# Altium project Stream_Deck.PrjPcb
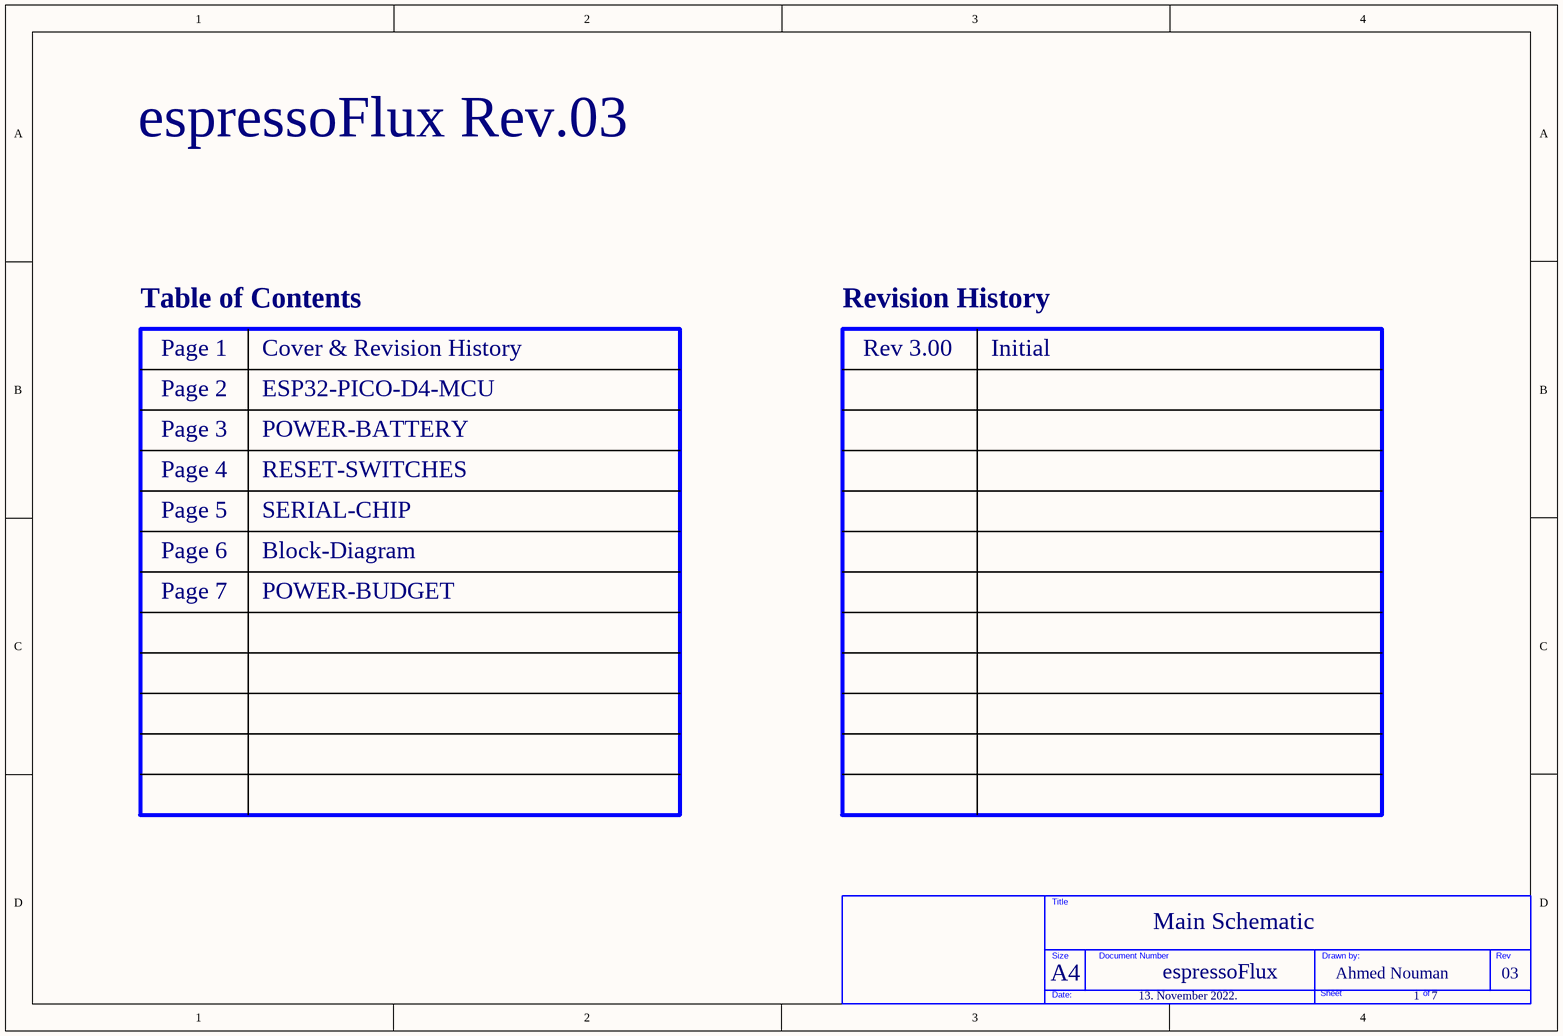
[diagram p0: Main Schematic.SchDoc]
7 sheets, 121 parts. Net scope: flat (ports and power ports of the same name join across sheets).
Board file: main.PcbDoc
Sheets:
  Main Schematic.SchDoc
  ESP32-PICO-D4-MCU.SchDoc
  POWER-BATTERY.SchDoc
  RESET-SWITCHES.SchDoc
  SERIAL-CHIP.SchDoc
  BLOCK-DIAGRAM.SchDoc
  POWER-BUDGET.SchDoc

## Sheet Main Schematic.SchDoc
size A4; PageSetup: Record=PageOptions|CenterHorizontal=True|CenterVertical=True|PrintScale=0.49|XCorrection=1.00|YCorrection=1.00|PrintKind=1|BorderSize=5000000|LeftOffset=0|BottomOffset=0|Orientation=2|PaperLength=1000|PaperWidth=1000|Scale=100|PaperSource=15|PrintQuality=1200|MediaType=1|DitherType=10|PrintScaleMode=1|PaperKind=Letter|PaperIndex=1; SheetNumber: 1; SheetTotal: 7

### Parts
(Parts that share a designator on the sheet are numbered #1, #2 ... from top to bottom, then left to right.)
?#1  (no value)  (graphical)

### Notes on the sheet
- espressoFlux Rev.03
- Table of Contents
- Revision History
- Page 1
- Cover & Revision History
- Rev 3.00
- Initial
- Page 2
- Page 3
- ESP32-PICO-D4-MCU
- POWER-BATTERY
- Page 4
- Page 5
- RESET-SWITCHES
- SERIAL-CHIP
- Page 6
- Block-Diagram
- Page 7
- POWER-BUDGET
- A4
- Main Schematic
- espressoFlux
- Ahmed Nouman
- 03
- 13. November 2022.
- 1    7
- Title
- Size
- Document Number
- Drawn by:
- Rev
- Date:
- Sheet
- of

### Library data of the parts
?#1 = TITLE BLOCK_BLANK

## Sheet ESP32-PICO-D4-MCU.SchDoc
size A4; SheetNumber: 2; SheetTotal: 7
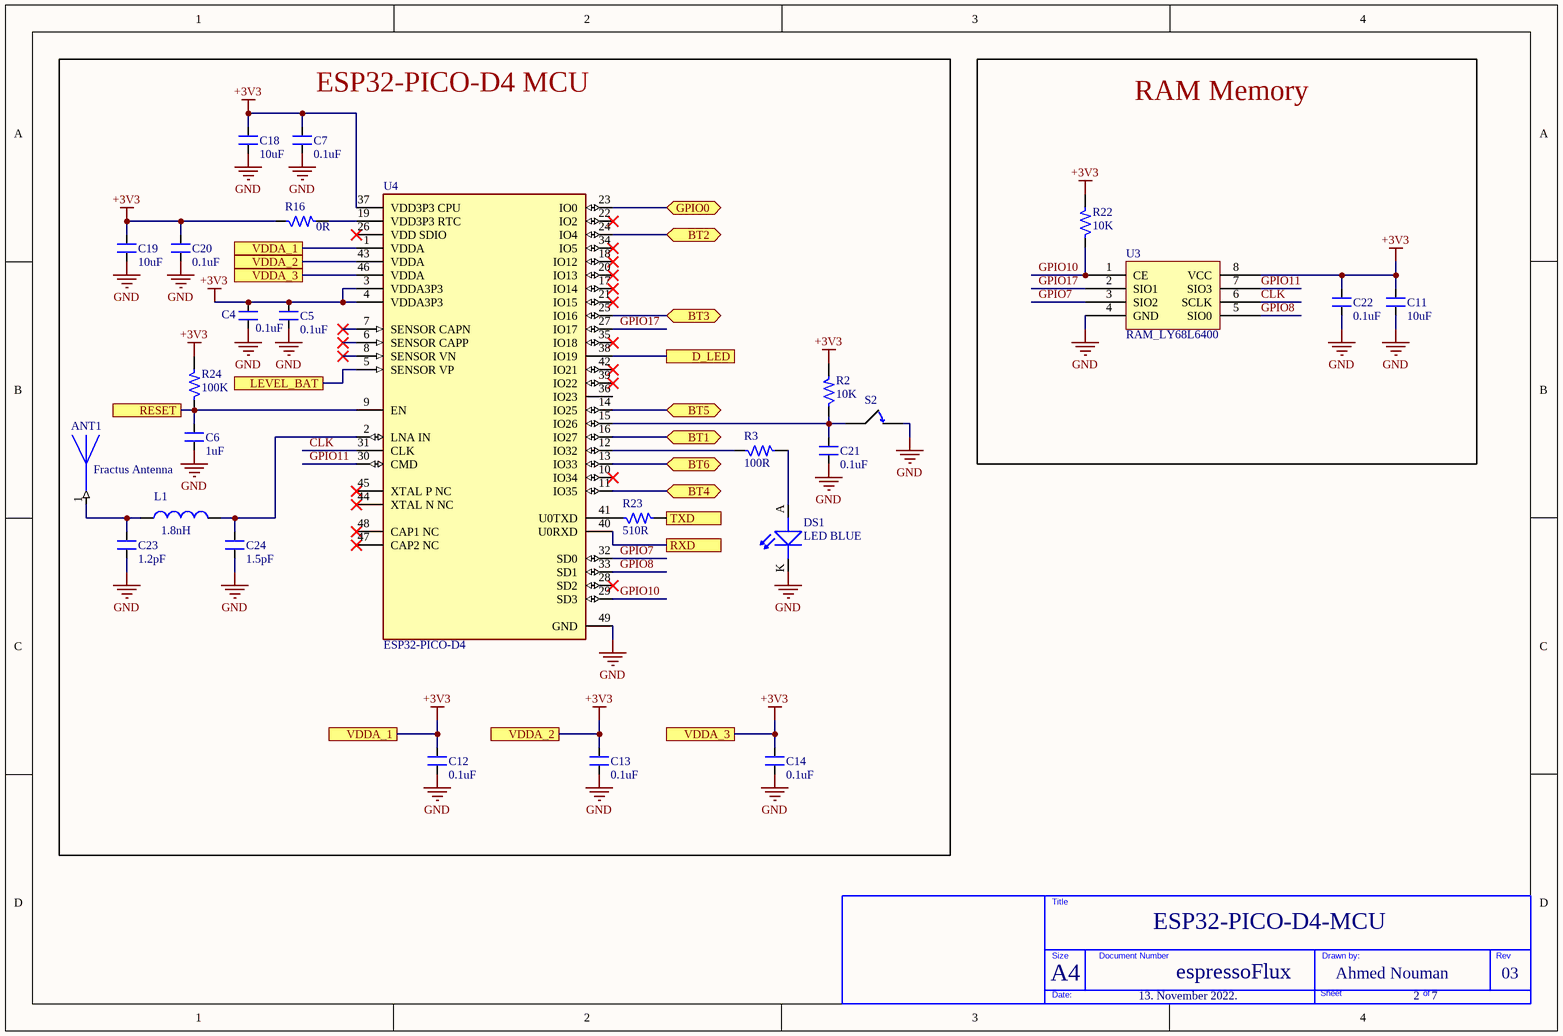
[diagram p1: ESP32-PICO-D4-MCU.SchDoc]

### Parts
(Parts that share a designator on the sheet are numbered #1, #2 ... from top to bottom, then left to right.)
?#2  (no value)  (graphical)
ANT1  Fractus Antenna  [Fractus_Antenna_NN01-102]
C4  0.1uF  [CAP_0805]
C5  0.1uF  [CAP_0805]
C6  1uF  [CAP_0805]
C7  0.1uF  [CAP_0805]
C11  10uF  [CAP_0805]
C12  0.1uF  [CAP_0805]
C13  0.1uF  [CAP_0805]
C14  0.1uF  [CAP_0805]
C18  10uF  [CAP_0805]
C19  10uF  [CAP_0805]
C20  0.1uF  [CAP_0805]
C21  0.1uF  [CAP_0805]
C22  0.1uF  [CAP_0805]
C23  1.2pF  [CAPC1608N]
C24  1.5pF  [CAPC1608N]
DS1  LED BLUE  [LED_0805]
L1  1.8nH  [RESC1608N]
R2  10K  [RES_0805]
R3  100R  [RES_0805]
R16  0R  [RES_0805]
R22  10K  [RES_0805]
R23  510R  [RES_0805]
R24  100K  [RES_0805]
S2  Button Tactile Switch, NO 0.05 A 0.8mm  [Button8014X17N]  (value not drawn)
U3  RAM_LY68L6400  [SOP-8]
U4  ESP32-PICO-D4  [Espressif_Systems_0_IPC_A]

### Blocks framed on the sheet
ESP32-PICO-D4 MCU: ANT1 C4-C7 C12-C14 C18-C21 C23 C24 DS1 L1 R2 R3 R16 R23 R24 S2 U4
RAM Memory: C11 C22 R22 U3

### Ports
BT1 (bidir), BT2 (bidir), BT3 (bidir), BT4 (bidir), BT5 (bidir), BT6 (bidir), D_LED, GPIO0 (bidir), LEVEL_BAT, RESET, RXD, TXD, VDDA_1, VDDA_2, VDDA_3

### Nets
+3V3: C4.2 C5.2 C7.2 C11.2 C12.2 C13.2 C14.2 C18.2 C19.2 C20.2 C22.2 R2.2 R16.1 R22.2 R24.2 U3.8(VCC) U4.1(VDDA) U4.3(VDDA3P3) U4.4(VDDA3P3) U4.37(VDD3P3_CPU) U4.43(VDDA) U4.46(VDDA) ; port VDDA_1, port VDDA_2, port VDDA_3
GND: C4.1 C5.1 C6.1 C7.1 C11.1 C12.1 C13.1 C14.1 C18.1 C19.1 C20.1 C21.1 C22.1 C23.1 C24.1 DS1.K(CATHODE) S2.2 U3.4(GND) U4.49(GND)
BT1: U4.16(IO27) ; port BT1
BT2: U4.24(IO4) ; port BT2
BT3: U4.25(IO16) ; port BT3
BT4: U4.11(IO35) ; port BT4
BT5: U4.14(IO25) ; port BT5
BT6: U4.13(IO33) ; port BT6
CLK: U3.6(SCLK) U4.31(CLK)
D_LED: U4.38(IO19) ; port D_LED
GPIO0: U4.23(IO0) ; port GPIO0
GPIO7: U3.3(SIO2) U4.32(SD0)
GPIO8: U3.5(SIO0) U4.33(SD1)
GPIO10: R22.1 U3.1(CE) U4.29(SD3)
GPIO11: U3.7(SIO3) U4.30(CMD)
GPIO17: U3.2(SIO1) U4.27(IO17)
LEVEL_BAT: U4.5(SENSOR_VP) ; port LEVEL_BAT
RESET: C6.2 R24.1 U4.9(EN) ; port RESET
RXD: U4.40(U0RXD) ; port RXD
TXD: R23.2 ; port TXD
NetANT1_1: ANT1.1 C23.2 L1.1
NetC21_2: C21.2 R2.1 S2.1 U4.15(IO26)
NetC24_2: C24.2 L1.2 U4.2(LNA_IN)
NetDS1_A: DS1.A(ANODE) R3.2
NetR3_1: R3.1 U4.12(IO32)
NetR16_2: R16.2 U4.19(VDD3P3_RTC)
NetR23_1: R23.1 U4.41(U0TXD)

Not connected (* = marked no-connect by the designer): U4 6(SENSOR_CAPP)* 7(SENSOR_CAPN)* 8(SENSOR_VN)* 10(IO34)* 17(IO14)* 18(IO12)* 20(IO13)* 21(IO15)* 22(IO2)* 26(VDD_SDIO)* 28(SD2)* 34(IO5)* 35(IO18)* 36(IO23) 39(IO22)* 42(IO21)* 44(XTAL_N_NC)* 45(XTAL_P_NC)* 47(CAP2_NC)* 48(CAP1_NC)*

### Notes on the sheet
- A4
- ESP32-PICO-D4-MCU
- espressoFlux
- Ahmed Nouman
- 03
- 13. November 2022.
- 2    7
- Title
- Size
- Document Number
- Drawn by:
- Rev
- Date:
- Sheet
- of

### Library data of the parts
?#2 = TITLE BLOCK_BLANK
ANT1 = ANT_2.45GHz_Bluetooth_WLAN_Zigbee_1.7dBi_NN01-102: 2.45GHz Bluetooth, WLAN, Zigbe Chip RF Antenna 2.4GHz ~ 2.5GHz 1.7dBi Solder Surface Mount
C4 C5 C7 C12-C14 C20-C22 = CAP_0.1uF-50V-10%-0805: 0.1µF ±10% 50V Ceramic Capacitor X7R 0805 (2012 Metric); Manufacturer: Samsung; Manufacturer Part Number: CL21B104KBCNNNC; Alternate Part Number-1: NA; Case/Package: 0805; Supplier-1: SIRICOM; Supplier Part Number-1: 0805B104K500CT
C6 C23 C24 = CAP_1uF-50V-10%-0805_1: 1µF ±10% 50V Ceramic Capacitor X7R 0805 (2012 Metric); Manufacturer: Samsung; Manufacturer Part Number: CL21B104KBCNNNC; Alternate Part Number-1: NA; Case/Package: 0805; Supplier-1: SIRICOM; Supplier Part Number-1: 0805B104K500CT
C11 C18 C19 = CAP_10uF-50V-10%-0805_1: 10µF ±10% 50V Ceramic Capacitor X7R 0805 (2012 Metric); Manufacturer: Samsung; Manufacturer Part Number: CL21B104KBCNNNC; Alternate Part Number-1: NA; Case/Package: 0805; Supplier-1: SIRICOM; Supplier Part Number-1: 0805B104K500CT
DS1 = LED_BLUE-3V3-20mA-0805: Blue 470nm LED Indication - Discrete 3.3V 0805 (2012 Metric); Manufacturer: Vishay Lite-On; Manufacturer Part Number: LTST-C171TBKT; Alternate Part Number-1: NA; Case/Package: 0805; Supplier-1: SP ROAD; Supplier Part Number-1: LTST-C171TBKT
L1 = Inductor: Code_IEC: 1005; Value: MPZ1608S601A; Published: 8-Jun-2000; LatestRevisionDate: 17-Jul-2002; LatestRevisionNote: Re-released for DXP Platform.; PackageReference: 0402-A; Publisher: Altium Limited; Code_JEITA: 0402
R2 R22 = RES_10K-0.125W-1%-0805: 10 kOhms ±1% 0.125W, 1/8W Chip Resistor 0805 (2012 Metric) Automotive AEC-Q200 Thick Film; Manufacturer: CTS; Manufacturer Part Number: WR08X1002FTL; Case/Package: 0805; Supplier-1: SIRICOM; Supplier Part Number-1: WR08X1002FTL; Alternate Part Number-1: WR08X1002FTL
R3 = RES_100R-0.125W-1%-0805: 100 Ohms ±1% 0.125W, 1/8W Chip Resistor 0805 (2012 Metric) Automotive AEC-Q200, Pulse Withstanding Thick Film; Manufacturer: Walsin; Manufacturer Part Number: WR08X1000FTL; Case/Package: 0805; Supplier-1: SIRICOM; Supplier Part Number-1: WR08X1000FTL; Alternate Part Number-1: WR08X1000FTL
R16 = RES_0R-0.125W-1%-0805: 0 Ohms Jumper 0.125W, 1/8W Chip Resistor 0805 (2012 Metric) Automotive AEC-Q200 Thick Film; Manufacturer: Walsin; Manufacturer Part Number: WR08X000PTL; Case/Package: 0805; Supplier-1: SIRICOM; Supplier Part Number-1: WR08X000PTL; Alternate Part Number-1: WR08X000PTL
R23 = RES_510R-0.125W-1%-0805: 510 Ohms ±1% 0.125W, 1/8W Chip Resistor 0805 (2012 Metric) Thin Film; Manufacturer: Yageo; Manufacturer Part Number: RT0805FRE07510RL; Alternate Part Number-1: NA; Case/Package: 0805; Supplier-1: SIRICOM; Supplier Part Number-1: WR08X5100FTL
R24 = RES_10K-0.125W-1%-0805: 100 kOhms ±1% 0.125W, 1/8W Chip Resistor 0805 (2012 Metric) Automotive AEC-Q200 Thick Film; Manufacturer: CTS; Manufacturer Part Number: WR08X1002FTL; Case/Package: 0805; Supplier-1: SIRICOM; Supplier Part Number-1: WR08X1002FTL; Alternate Part Number-1: WR08X1002FTL
S2 = Button Tactile Switch, NO 0.05 A 0.8mm: Manufacturer: C & K; Manufacturer Part No.: B3F1000; State: Normaly Open; Date Created: 25 February 2015; Creator: R Kanjee; RS Stock No.: 516-255

## Sheet POWER-BATTERY.SchDoc
size A4; SPICEModelCacheDLZXOQBQ: <root> / <DocumentId>DLZXOQBQ</DocumentId> / <CacheFrame Number="0"> / <Model Name="skydiode" Kind="MDL"> / <Text>*Default Schottky Diode / *Schottky Diode Pinout: A,K / .MODEL SKYDIODE D(EG=0.69 XTI=2)</Text> / </Model> / </CacheFrame> / </root>; SheetNumber: 3; SheetTotal: 7
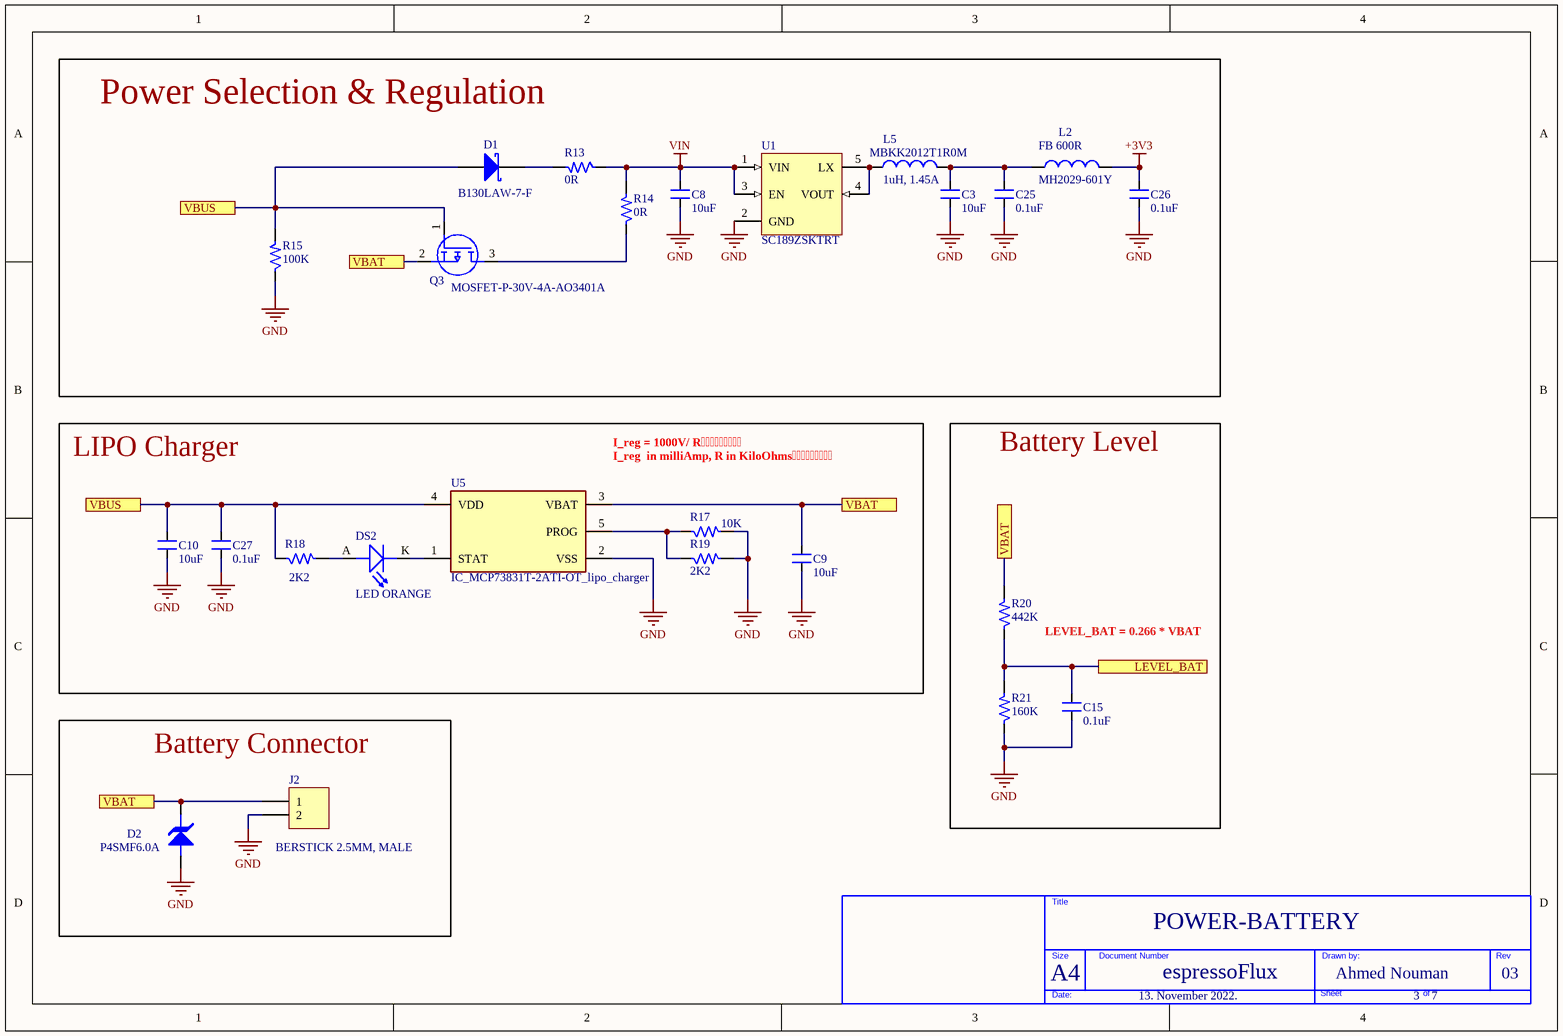
[diagram p2: POWER-BATTERY.SchDoc]

### Parts
(Parts that share a designator on the sheet are numbered #1, #2 ... from top to bottom, then left to right.)
?#3  (no value)  (graphical)
C3  10uF  [CAP_0805]
C8  10uF  [CAP_0805]
C9  10uF  [CAP_0805]
C10  10uF  [CAP_0805]
C15  0.1uF  [CAP_0805]
C25  0.1uF  [CAP_0805]
C26  0.1uF  [CAP_0805]
C27  0.1uF  [CAP_0805]
D1  B130LAW-7-F  [SOD123 - DOT]
D2  P4SMF6.0A  [SOD123FL]
DS2  LED ORANGE  [LED_0805]
J2  BERSTICK 2.5MM, MALE  [CON2_100_43D62_TH_ST]
L2  MH2029-601Y  [INDC2012N]
L5  MBKK2012T1R0M  [INDC2012N]
Q3  MOSFET-P-30V-4A-AO3401A  [P_channelMos_AO3401A]
R13  0R  [RES_0805]
R14  0R  [RES_0805]
R15  100K  [RES_0805]
R17  10K  [RES_0805]
R18  2K2  [RES_0805]
R19  2K2  [RES_0805]
R20  442K  [RES_0805]
R21  160K  [RES_0805]
U1  SC189ZSKTRT  [SOT23-5]
U5  IC_MCP73831T-2ATI-OT_lipo_charger  [SOT23-5]

### Blocks framed on the sheet
Power Selection & Regulation: C3 C8 C25 C26 D1 L2 L5 Q3 R13-R15 U1
LIPO Charger: C9 C10 C27 DS2 R17-R19 U5
Battery Level: C15 R20 R21
Battery Connector: D2 J2

### Ports
LEVEL_BAT, VBAT, VBUS

### Nets
+3V3: C26.2 L2.2
GND: C3.1 C8.1 C9.1 C10.1 C15.1 C25.1 C26.1 C27.1 D2.1 J2.2 R15.1 R17.2 R19.2 R21.1 U1.2(GND) U5.2(VSS)
VIN: C8.2 R13.1 R14.2 U1.1(VIN) U1.3(EN)
LEVEL_BAT: C15.2 R20.1 R21.2 ; port LEVEL_BAT
VBAT: C9.2 D2.2 J2.1 Q3.2(S) R20.2 U5.3(VBAT) ; port VBAT
VBUS: C10.2 C27.2 D1.1(A) Q3.1(G) R15.2 R18.1 U5.4(VDD) ; port VBUS
NetC3_2: C3.2 C25.2 L2.1 L5.2
NetD1_2: D1.2(K) R13.2
NetDS2_A: DS2.A(ANODE) R18.2
NetDS2_K: DS2.K(CATHODE) U5.1(STAT)
NetL5_1: L5.1 U1.4(VOUT) U1.5(LX)
NetQ3_3: Q3.3(D) R14.1
NetR17_1: R17.1 R19.1 U5.5(PROG)

### Notes on the sheet
- (near L2) FB 600R
- 1uH, 1.45A
- I_reg = 1000V/ R
- I_reg  in milliAmp, R in KiloOhms
- LEVEL_BAT = 0.266 * VBAT
- A4
- POWER-BATTERY
- espressoFlux
- Ahmed Nouman
- 03
- 13. November 2022.
- 3    7
- Title
- Size
- Document Number
- Drawn by:
- Rev
- Date:
- Sheet
- of

### Library data of the parts
?#3 = TITLE BLOCK_BLANK
C3 C8 = CAP_1uF-50V-10%-0805_1: as C6 on sheet ESP32-PICO-D4-MCU; Case/Package: 0805; Supplier-1: SIRICOM; Supplier Part Number-1: 0805B104K500CT
C9 C10 = CAP_10uF-50V-10%-0805_1: as C11 on sheet ESP32-PICO-D4-MCU; Case/Package: 0805; Supplier-1: SIRICOM; Supplier Part Number-1: 0805B104K500CT
C15 C25-C27 = CAP_0.1uF-50V-20%-0805: 0.1µF ±20% 50V Ceramic Capacitor X7R 0805 (2012 Metric); Manufacturer: Samsung Electro-Mechanics; Manufacturer Part Number: CL21B104MBCNNNC; Alternate Part Number-1: NA; Case/Package: 0805; Supplier-1: SIRICOM; Supplier Part Number-1: 0805B104K500CT
D1 = D Schottky: Schottky Diode; Published: 8-Jun-2000; LatestRevisionDate: 17-Jul-2002; LatestRevisionNote: Re-released for DXP Platform.; PackageReference: SMB; Publisher: Altium Limited; PackageDescription: DO-214-AA/SMB; 2 C-Bend Leads; Body 5.3 x 3.6 mm, inc. leads (LxW); Code_JEDEC: DO-214-AA
D2 = TVS-UNIDIRECTIONAL: Value: *
DS2 = LED_ORANGE-2V-20mA-0805: Orange 605nm LED Indication - Discrete 2V 0805 (2012 Metric); Manufacturer: Vishay Lite-On; Manufacturer Part Number: LTST-C170KFKT; Alternate Part Number-1: NA; Case/Package: 0805; Supplier-1: SP ROAD; Supplier Part Number-1: LTST-C170KFKT
J2 = CON-BS-PLG_2X1-100-ST-TH: 2 Pins, 1 Row 2.54mm Pitch, Straight bergstrip, Male; Manufacturer Part Number: NA; Manufacturer: Samtec; Case/Package: TH-CON; Supplier-1: SP ROAD; Supplier Part Number-1: NA; Alternate Part Number-1: NA
L2 = Inductor: Code_IEC: 1005; Value: MPZ1608S601A; Published: 8-Jun-2000; LatestRevisionDate: 17-Jul-2002; LatestRevisionNote: Re-released for DXP Platform.; PackageReference: 0402-A; Publisher: Altium Limited; Code_JEITA: 0402
L5 = Inductor: 1 µH Shielded Drum Core, Wirewound Inductor 1.45 A 106mOhm Max 0805 (2012 Metric); Code_IEC: 1005; Value: MPZ1608S601A; Published: 8-Jun-2000; LatestRevisionDate: 17-Jul-2002; LatestRevisionNote: Re-released for DXP Platform.; PackageReference: 0402-A; Publisher: Altium Limited; Code_JEITA: 0402
Q3 = MOSFET-P-30V-4A-AO3401A: 30V P-Channel MOSFET 4A Rdson = 85 mOhms
R13 R14 = RES_0R-0.125W-1%-0805: as R16 on sheet ESP32-PICO-D4-MCU; Case/Package: 0805; Supplier-1: SIRICOM; Supplier Part Number-1: WR08X000PTL; Alternate Part Number-1: WR08X000PTL
R15 = RES_100K-0.125W-1%-0805: 100 kOhms ±1% 0.125W, 1/8W Chip Resistor 0805 (2012 Metric) Automotive AEC-Q200 Thick Film; Manufacturer: Walsin; Manufacturer Part Number: WR08X1003FTL; Alternate Part Number-1: NA; Case/Package: 0805; Supplier-1: SIRICOM; Supplier Part Number-1: WR08X1003FTL
R17 = RES_10K-0.125W-1%-0805: as R2 on sheet ESP32-PICO-D4-MCU; Case/Package: 0805; Supplier-1: SIRICOM; Supplier Part Number-1: WR08X1002FTL; Alternate Part Number-1: WR08X1002FTL
R18 R19 = RES_2.2K-0.125W-1%-0805: 2.2 kOhms ±1% 0.125W, 1/8W Chip Resistor 0805 (2012 Metric) Thick Film; Manufacturer: Stackpole Electronics; Manufacturer Part Number: CRG0805F2K2; Alternate Part Number-1: CR0805F82201G; Case/Package: 0805; Supplier-1: SIRICOM; Supplier Part Number-1: WR08X2201FTL
R20 = RES_442K-0.125W-1%-0805_1: 442kOhms ±1% 0.125W, 1/8W Chip Resistor 0805 (2012 Metric) Thick Film; Manufacturer: TE Connectivity Passive Product; Manufacturer Part Number: CRG0805F1K5; Alternate Part Number-1: NA; Case/Package: 0805; Supplier-1: SIRICOM; Supplier Part Number-1: NA
R21 = RES_160K-0.125W-1%-0805_1_1: 160kOhms ±1% 0.125W, 1/8W Chip Resistor 0805 (2012 Metric) Thick Film; Manufacturer: TE Connectivity Passive Product; Manufacturer Part Number: CRG0805F1K5; Alternate Part Number-1: NA; Case/Package: 0805; Supplier-1: SIRICOM; Supplier Part Number-1: NA
U1 = SC189ZSKTRT: Buck Switching Regulator IC Positive Fixed 3.3V 1 Output 1.5A SC-74A, SOT-753

## Sheet RESET-SWITCHES.SchDoc
size A4; SPICEModelCacheRHDPLAFM: <root> / <DocumentId>RHDPLAFM</DocumentId> / </root>; SheetNumber: 4; SheetTotal: 7
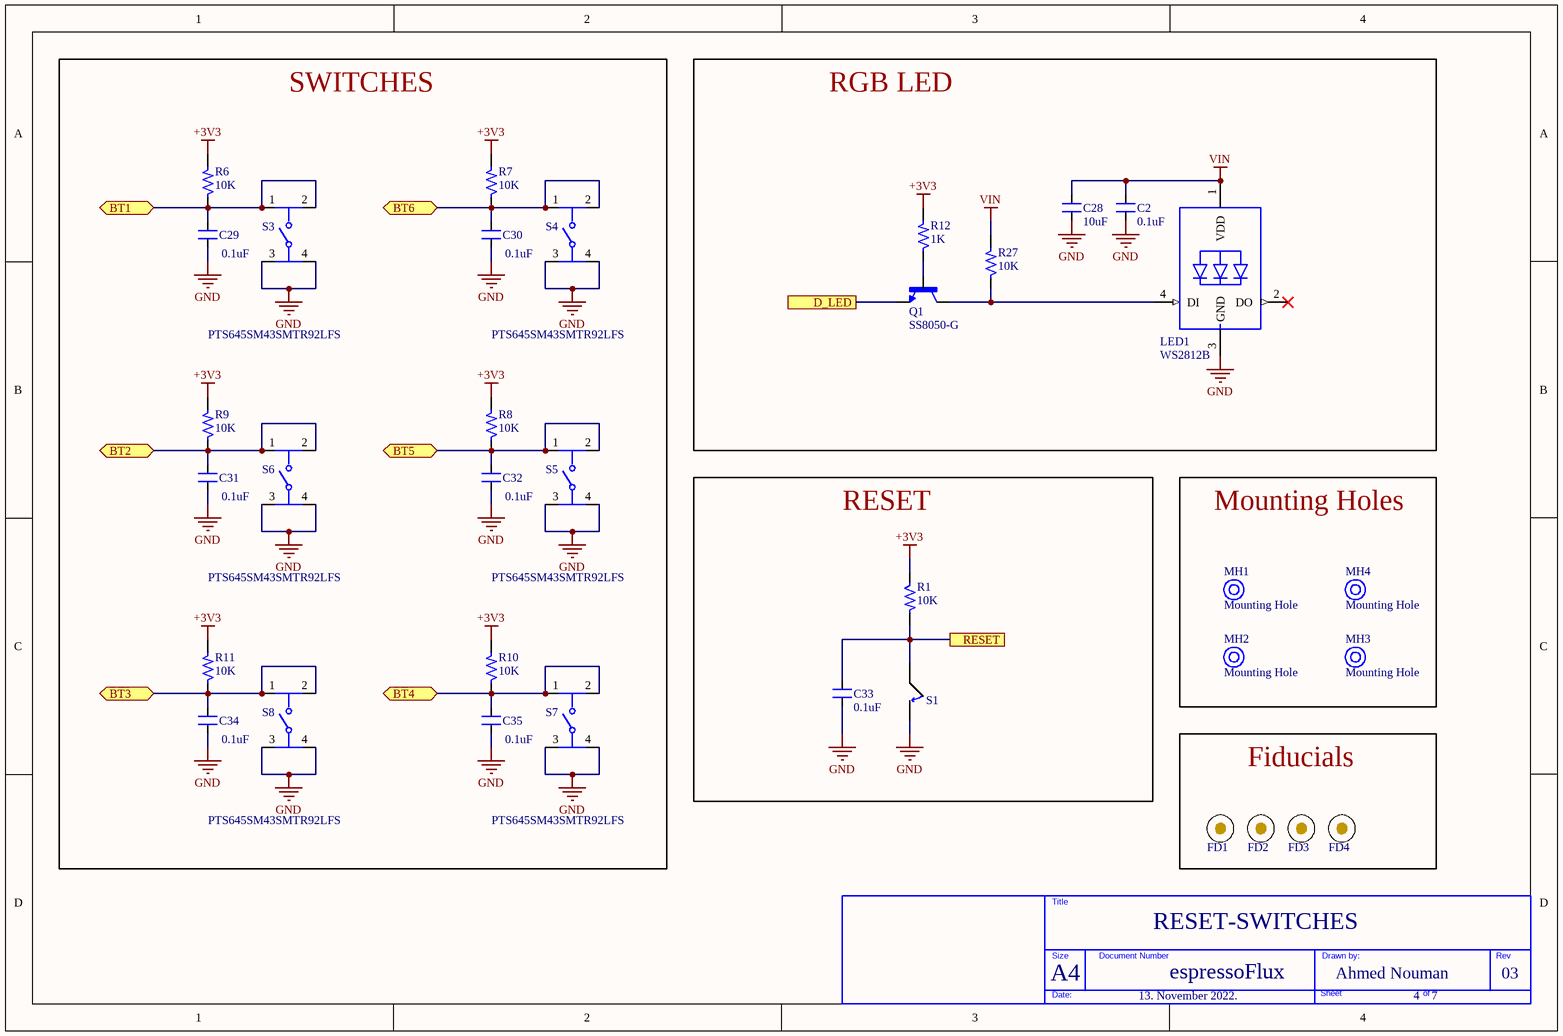
[diagram p3: RESET-SWITCHES.SchDoc]

### Parts
(Parts that share a designator on the sheet are numbered #1, #2 ... from top to bottom, then left to right.)
?#4  (no value)  (graphical)
C2  0.1uF  [CAP_0805]
C28  10uF  [CAP_0805]
C29  0.1uF  [CAP_0805]
C30  0.1uF  [CAP_0805]
C31  0.1uF  [CAP_0805]
C32  0.1uF  [CAP_0805]
C33  0.1uF  [CAP_0805]
C34  0.1uF  [CAP_0805]
C35  0.1uF  [CAP_0805]
FD1  Fiducial  [FIDUCIAL-TB-1mm]  (value not drawn)
FD2  Fiducial  [FIDUCIAL-TB-1mm]  (value not drawn)
FD3  Fiducial  [FIDUCIAL-TB-1mm]  (value not drawn)
FD4  Fiducial  [FIDUCIAL-TB-1mm]  (value not drawn)
LED1  WS2812B  [WS2812B]
MH1  Mounting Hole  [MOUNTING-NO-COPPER]
MH2  Mounting Hole  [MOUNTING-NO-COPPER]
MH3  Mounting Hole  [MOUNTING-NO-COPPER]
MH4  Mounting Hole  [MOUNTING-NO-COPPER]
Q1  SS8050-G  [TRANS_NPN_SS8050-G]
R1  10K  [RES_0805]
R6  10K  [RES_0805]
R7  10K  [RES_0805]
R8  10K  [RES_0805]
R9  10K  [RES_0805]
R10  10K  [RES_0805]
R11  10K  [RES_0805]
R12  1K  [RES_0805]
R27  10K  [RES_0805]
S1  Button Tactile Switch, NO 0.05 A 0.8mm  [Button8014X17N]  (value not drawn)
S3  PTS645SM43SMTR92LFS  [C&K_0_MFG - duplicate]
S4  PTS645SM43SMTR92LFS  [C&K_0_MFG - duplicate]
S5  PTS645SM43SMTR92LFS  [C&K_0_MFG - duplicate]
S6  PTS645SM43SMTR92LFS  [C&K_0_MFG - duplicate]
S7  PTS645SM43SMTR92LFS  [C&K_0_MFG - duplicate]
S8  PTS645SM43SMTR92LFS  [C&K_0_MFG - duplicate]

### Blocks framed on the sheet
SWITCHES: C29-C32 C34 C35 R6-R11 S3-S8
RGB LED: C2 C28 LED1 Q1 R12 R27
RESET: C33 R1 S1
Mounting Holes: MH1-MH4
Fiducials: FD1-FD4

### Ports
BT1 (bidir), BT2 (bidir), BT3 (bidir), BT4 (bidir), BT5 (bidir), BT6 (bidir), D_LED, RESET

### Nets
+3V3: R1.1 R6.2 R7.2 R8.2 R9.2 R10.2 R11.2 R12.2
GND: C2.1 C28.1 C29.1 C30.1 C31.1 C32.1 C33.1 C34.1 C35.1 LED1.3(GND) S1.2 S3.3 S3.4 S4.3 S4.4 S5.3 S5.4 S6.3 S6.4 S7.3 S7.4 S8.3 S8.4
VIN: C2.2 C28.2 LED1.1(VDD) R27.2
BT1: C29.2 R6.1 S3.1 S3.2 ; port BT1
BT2: C31.2 R9.1 S6.1 S6.2 ; port BT2
BT3: C34.2 R11.1 S8.1 S8.2 ; port BT3
BT4: C35.2 R10.1 S7.1 S7.2 ; port BT4
BT5: C32.2 R8.1 S5.1 S5.2 ; port BT5
BT6: C30.2 R7.1 S4.1 S4.2 ; port BT6
D_LED: Q1.2(E) ; port D_LED
RESET: C33.2 R1.2 S1.1 ; port RESET
NetLED1_4: LED1.4(DI) Q1.3(C) R27.1
NetQ1_1: Q1.1(B) R12.1

Not connected (* = marked no-connect by the designer): LED1 2(DO)*

### Notes on the sheet
- A4
- RESET-SWITCHES
- espressoFlux
- Ahmed Nouman
- 03
- 13. November 2022.
- 4    7
- Title
- Size
- Document Number
- Drawn by:
- Rev
- Date:
- Sheet
- of

### Library data of the parts
?#4 = TITLE BLOCK_BLANK
C2 C29-C35 = CAP_0.1uF-50V-10%-0805: as C4 on sheet ESP32-PICO-D4-MCU; Case/Package: 0805; Supplier-1: SIRICOM; Supplier Part Number-1: 0805B104K500CT
C28 = CAP_10uF-50V-10%-0805_1: as C11 on sheet ESP32-PICO-D4-MCU; Case/Package: 0805; Supplier-1: SIRICOM; Supplier Part Number-1: 0805B104K500CT
FD1-FD4 = Fiducial: Fiducial mark; SymbolCreator: codlsc; SymbolVersion: 2009-11-4; CompType: Fiducial; Publisher: Texas Instruments; LatestRevisionDate: 2013-07-11; LatestRevisionNote: Added Alternate PartNumber and Alternate Manufacturer parameters to appropriate components.; Manufacturer: N/A; MountType: N/A; PackageReference: Fiducial; PartNumber: N/A; ClassName: FiducialMark
LED1 = WS2812B: Raspberry Pi HAT _40 pin_ Wheeled Robotics Kit; MF: SparkFun Electronics; Availability: Unavailable; SnapEDA_Link: https://www.snapeda.com/parts/WS2812B/Worldsemi/view-part/1038297/?ref=snap; MP: WS2812B; Price: None; Value: *; Package: None
MH1-MH4 = MH_3H_ONLY_1: Manufacturer Part Number: NA; Case/Package: TH; Manufacturer: NA; Supplier-1: NA; Supplier Part Number-1: NA; Alternate Part Number-1: NA
Q1 = TRANS_NPN_SS8050-G: Bipolar (BJT) Transistor NPN 25 V 1.5 A 100MHz 300 mW Surface Mount SOT-23-3
R1 R6-R11 = RES_10K-0.125W-1%-0805: as R2 on sheet ESP32-PICO-D4-MCU; Case/Package: 0805; Supplier-1: SIRICOM; Supplier Part Number-1: WR08X1002FTL; Alternate Part Number-1: WR08X1002FTL
R12 = RES_330R-0.125W-1%-0805: 1 KOhms ±1% 0.125W, 1/8W Chip Resistor 0805 (2012 Metric) Automotive AEC-Q200 Thick Film; Manufacturer: Walsin; Manufacturer Part Number: WR08X3300FTL; Alternate Part Number-1: NA; Case/Package: 0805; Supplier-1: SIRICOM; Supplier Part Number-1: WR08X3300FTL
R27 = RES_330R-0.125W-1%-0805: 10 KOhms ±1% 0.125W, 1/8W Chip Resistor 0805 (2012 Metric) Automotive AEC-Q200 Thick Film; Manufacturer: Walsin; Manufacturer Part Number: WR08X3300FTL; Alternate Part Number-1: NA; Case/Package: 0805; Supplier-1: SIRICOM; Supplier Part Number-1: WR08X3300FTL
S1 = Button Tactile Switch, NO 0.05 A 0.8mm: as S2 on sheet ESP32-PICO-D4-MCU; Date Created: 25 February 2015; Creator: R Kanjee; RS Stock No.: 516-255
S3-S8 = SW_TACTILE_PTS645SM43SMTR92LFS

## Sheet SERIAL-CHIP.SchDoc
size A4; SheetNumber: 5; SheetTotal: 7
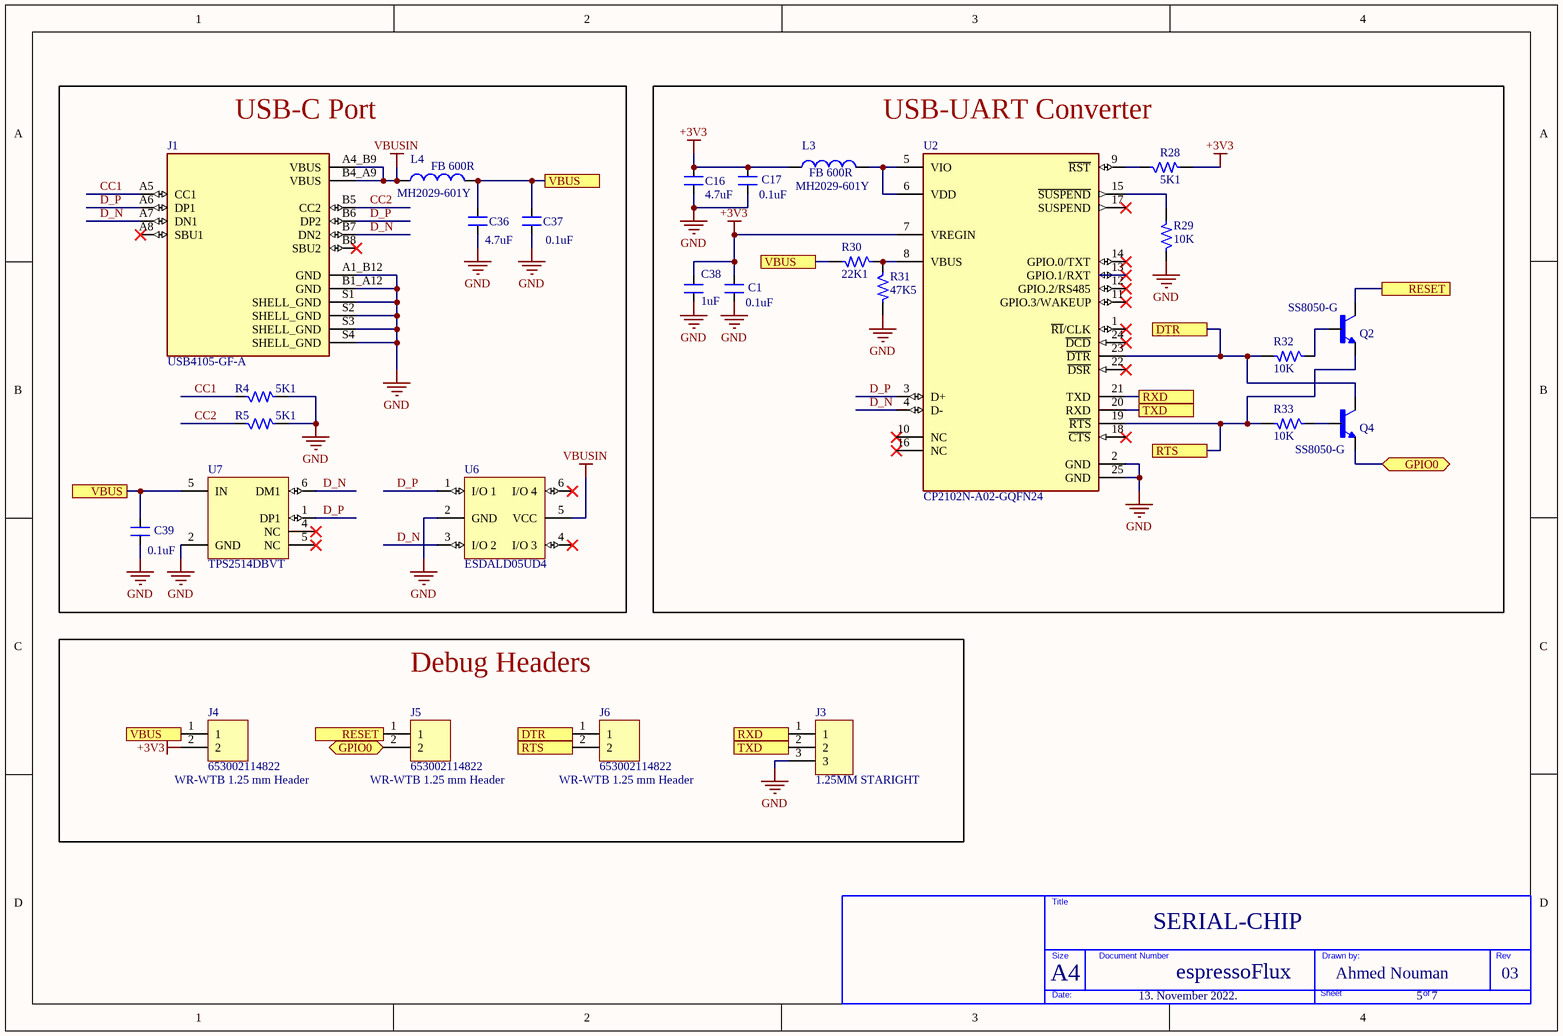
[diagram p4: SERIAL-CHIP.SchDoc]

### Parts
(Parts that share a designator on the sheet are numbered #1, #2 ... from top to bottom, then left to right.)
?#5  (no value)  (graphical)
C1  0.1uF  [CAP_0805]
C16  4.7uF  [CAP_0805]
C17  0.1uF  [CAP_0805]
C36  4.7uF  [CAP_0805]
C37  0.1uF  [CAP_0805]
C38  1uF  [CAP_0805]
C39  0.1uF  [CAP_0805]
J1  USB4105-GF-A  [CON_USB_C_USB2.0_USB4105-GF-A]
J3  1.25MM STARIGHT  [CON3_probing_1.25mm]
J4  653002114822  [CON2_probing_1.25mm]
J5  653002114822  [CON2_probing_1.25mm]
J6  653002114822  [CON2_probing_1.25mm]
L3  MH2029-601Y  [INDC2012N]
L4  MH2029-601Y  [INDC2012N]
Q2  SS8050-G  [TRANS_NPN_SS8050-G]
Q4  SS8050-G  [TRANS_NPN_SS8050-G]
R4  5K1  [RES_0805]
R5  5K1  [RES_0805]
R28  5K1  [RES_0805]
R29  10K  [RES_0805]
R30  22K1  [RES_0805]
R31  47K5  [RES_0805]
R32  10K  [RES_0805]
R33  10K  [RES_0805]
U2  CP2102N-A02-GQFN24  [QFN24-4X4]
U6  ESDALD05UD4  [SOT26A-6N]
U7  TPS2514DBVT  [SOT26A-6N]

### Blocks framed on the sheet
USB-C Port: C36 C37 C39 J1 L4 R4 R5 U6 U7
USB-UART Converter: C1 C16 C17 C38 L3 Q2 Q4 R28-R33 U2
Debug Headers: J3-J6

### Ports
DTR, GPIO0 (bidir), RESET, RTS, RXD, TXD, VBUS

### Nets
+3V3: C1.2 C16.2 C17.2 C38.2 J4.2 L3.1 R28.2 U2.7(VREGIN)
GND: C1.1 C16.1 C17.1 C36.1 C37.1 C38.1 C39.1 J1.A1_B12(GND) J1.B1_A12(GND) J1.S1(SHELL_GND) J1.S2(SHELL_GND) J1.S3(SHELL_GND) J1.S4(SHELL_GND) J3.3 R4.2 R5.2 R29.1 R31.2 U2.2(GND) U2.25(GND) U6.2(GND) U7.2(GND)
VBUSIN: J1.A4_B9(VBUS) J1.B4_A9(VBUS) L4.1 U6.5(VCC)
CC1: J1.A5(CC1) R4.1
CC2: J1.B5(CC2) R5.1
D_N: J1.A7(DN1) J1.B7(DN2) U2.4(D-) U6.3(I/O_2) U7.6(DM1)
D_P: J1.A6(DP1) J1.B6(DP2) U2.3(D+) U6.1(I/O_1) U7.1(DP1)
DTR: J6.1 Q4.3(C) R32.2 U2.23(~{DTR}) ; port DTR
GPIO0: J5.2 Q4.2(E) ; port GPIO0
RESET: J5.1 Q2.3(C) ; port RESET
RTS: J6.2 Q2.2(E) R33.2 U2.19(~{RTS}) ; port RTS
RXD: J3.1 U2.21(TXD) ; port RXD
TXD: J3.2 U2.20(RXD) ; port TXD
VBUS: C36.2 C37.2 C39.2 J4.1 L4.2 R30.2 U7.5(NC) ; port VBUS
NetL3_2: L3.2 U2.5(VIO) U2.6(VDD)
NetQ2_1: Q2.1(B) R32.1
NetQ4_1: Q4.1(B) R33.1
NetR28_1: R28.1 U2.9(~{RST})
NetR29_2: R29.2 U2.15(~{SUSPEND})
NetR30_1: R30.1 R31.1 U2.8(VBUS)

Not connected (* = marked no-connect by the designer): J1 A8(SBU1)* B8(SBU2)*; U2 1(~{RI}/CLK)* 10(NC)* 11(GPIO.3/WAKEUP)* 12(GPIO.2/RS485)* 13(GPIO.1/RXT)* 14(GPIO.0/TXT)* 16(NC)* 17(SUSPEND)* 18(~{CTS})* 22(~{DSR})* 24(~{DCD})*; U6 4(I/O_3)* 6(I/O_4)*; U7 4(NC)*

### Notes on the sheet
- (near L4) FB 600R
- (near L3) FB 600R
- (near J4) WR-WTB 1.25 mm Header
- (near J5) WR-WTB 1.25 mm Header
- (near J6) WR-WTB 1.25 mm Header
- A4
- SERIAL-CHIP
- espressoFlux
- Ahmed Nouman
- 03
- 13. November 2022.
- 5   7
- Title
- Size
- Document Number
- Drawn by:
- Rev
- Date:
- Sheet
- of

### Library data of the parts
?#5 = TITLE BLOCK_BLANK
C1 C17 C37 C39 = CAP_0.1uF-50V-10%-0805: as C4 on sheet ESP32-PICO-D4-MCU; Case/Package: 0805; Supplier-1: SIRICOM; Supplier Part Number-1: 0805B104K500CT
C16 C36 = CAP_1uF-50V-10%-0805_1: 4.7µF ±10% 50V Ceramic Capacitor X7R 0805 (2012 Metric); Manufacturer: Samsung; Manufacturer Part Number: CL21B104KBCNNNC; Alternate Part Number-1: NA; Case/Package: 0805; Supplier-1: SIRICOM; Supplier Part Number-1: 0805B104K500CT
C38 = CAP_1uF-50V-10%-0805_1: as C6 on sheet ESP32-PICO-D4-MCU; Case/Package: 0805; Supplier-1: SIRICOM; Supplier Part Number-1: 0805B104K500CT
J1 = CON_USB_C_USB2.0_USB4105-GF-A
J3 = CON-3-1.25MM-PROBING: 3 Pins, 1 Row 1.25mm Pitch, straight Connector, male; Manufacturer Part Number: 653003114822; Manufacturer: WURTH; Mating Part Number: 653003113322; Crimp Part Number: 653153128130; Alternate Part Number-1: NA; Case/Package: TH-CON; Supplier-1: WURTH; Supplier Part Number-1: 653003114822
J4-J6 = CON-2-1.25MM-PROPING: 2 Pins, 1 Row 1.25mm Pitch, Straight Connector, male; Manufacturer: JST; Mating Part Number: 653002113322; Crimp Part Number: 653153128130; Alternate Part Number-1: NA; Manufacturer Part Number: 653002114822; Case/Package: TH-CON; Supplier-1: WURTH; Supplier Part Number-1: 653002114822
L3 L4 = Inductor: Code_IEC: 1005; Value: MPZ1608S601A; Published: 8-Jun-2000; LatestRevisionDate: 17-Jul-2002; LatestRevisionNote: Re-released for DXP Platform.; PackageReference: 0402-A; Publisher: Altium Limited; Code_JEITA: 0402
Q2 Q4 = TRANS_NPN_SS8050-G: as Q1 on sheet RESET-SWITCHES
R4 R5 R28 = RES_5.1K-0.125W-1%-0805: 5.1 kOhms ±1% 0.125W, 1/8W Chip Resistor 0805 (2012 Metric) Moisture Resistant Thick Film; Manufacturer: Stackpole Electronics; Manufacturer Part Number: RC0805FR-075K9L; Alternate Part Number-1: NA; Case/Package: 0805; Supplier-1: SIRICOM; Supplier Part Number-1: WR08X5901FTL
R29 R32 R33 = RES_10K-0.125W-1%-0805: as R2 on sheet ESP32-PICO-D4-MCU; Case/Package: 0805; Supplier-1: SIRICOM; Supplier Part Number-1: WR08X1002FTL; Alternate Part Number-1: WR08X1002FTL
R30 = RES_5.1K-0.125W-1%-0805: 22K1 kOhms ±1% 0.125W, 1/8W Chip Resistor 0805 (2012 Metric) Moisture Resistant Thick Film; Manufacturer: Stackpole Electronics; Manufacturer Part Number: RC0805FR-075K9L; Alternate Part Number-1: NA; Case/Package: 0805; Supplier-1: SIRICOM; Supplier Part Number-1: WR08X5901FTL
R31 = RES_5.1K-0.125W-1%-0805: 47K5 kOhms ±1% 0.125W, 1/8W Chip Resistor 0805 (2012 Metric) Moisture Resistant Thick Film; Manufacturer: Stackpole Electronics; Manufacturer Part Number: RC0805FR-075K9L; Alternate Part Number-1: NA; Case/Package: 0805; Supplier-1: SIRICOM; Supplier Part Number-1: WR08X5901FTL
U6 = D5V0P4UR6SO: 16V Clamp 5.5A (8/20µs) Ipp Tvs Diode Surface Mount SOT23-6L
U7 = TPS2514DBVT: USB Charging Port Controller SOT-23-6 Texas Instruments TPS2514DBVT, Battery Charge Controller, 35mA, 6-Pin SOT-23; Geometry.Height: 1.45mm; Manufacturer_Name: Texas Instruments; Manufacturer_Part_Number: TPS2514DBVT; Mouser Part Number: 595-TPS2514DBVT; Mouser Price/Stock: https://www.mouser.co.uk/ProductDetail/Texas-Instruments/TPS2514DBVT?qs=7GxONfNUZSgiiGlogi3JDg%3D%3D; Arrow Part Number: TPS2514DBVT; Arrow Price/Stock: https://www.arrow.com/en/products/tps2514dbvt/texas-instruments?region=nac; Mouser Testing Part Number: *; Mouser Testing Price/Stock: *; Datasheet Link: http://www.ti.com/lit/ds/symlink/tps2514.pdf

## Sheet BLOCK-DIAGRAM.SchDoc
size A4; SheetNumber: 6; SheetTotal: 7
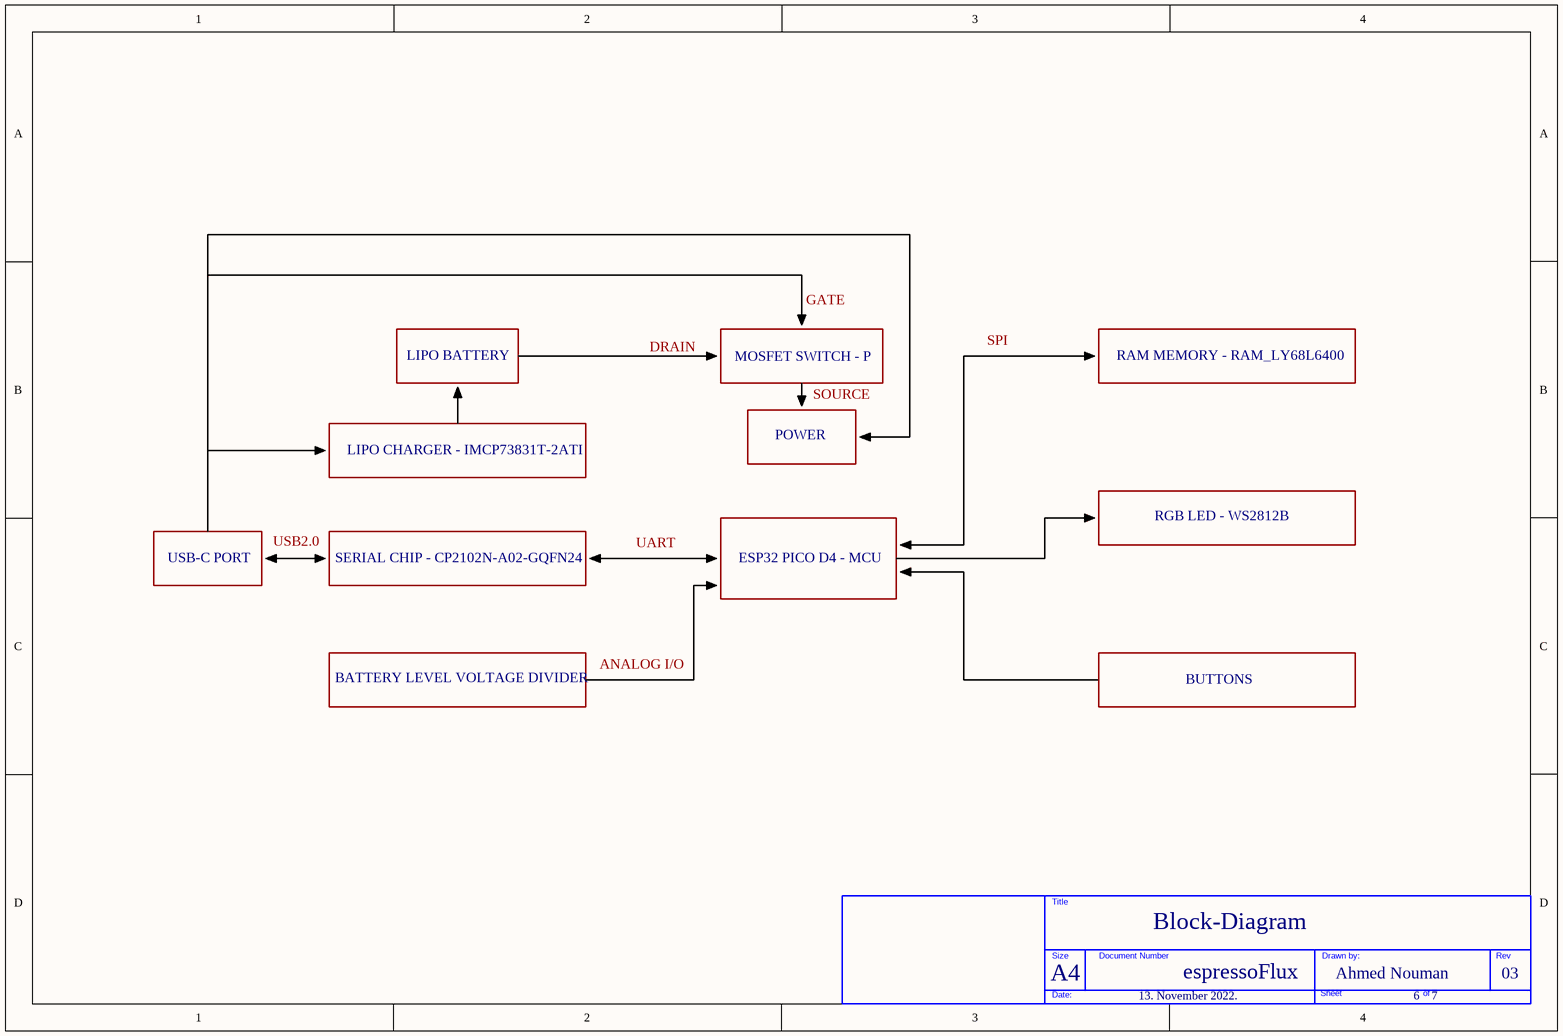
[diagram p5: BLOCK-DIAGRAM.SchDoc]

### Parts
(Parts that share a designator on the sheet are numbered #1, #2 ... from top to bottom, then left to right.)
?#6  (no value)  (graphical)

### Notes on the sheet
- GATE
- LIPO BATTERY
- DRAIN
- MOSFET SWITCH - P
- SPI
- RAM MEMORY - RAM_LY68L6400
- POWER
- SOURCE
- LIPO CHARGER - IMCP73831T-2ATI
- RGB LED - WS2812B
- USB-C PORT
- USB2.0
- SERIAL CHIP - CP2102N-A02-GQFN24
- UART
- ESP32 PICO D4 - MCU
- BATTERY LEVEL VOLTAGE DIVIDER
- ANALOG I/O
- BUTTONS
- A4
- Block-Diagram
- espressoFlux
- Ahmed Nouman
- 03
- 13. November 2022.
- 6    7
- Title
- Size
- Document Number
- Drawn by:
- Rev
- Date:
- Sheet
- of

### Library data of the parts
?#6 = TITLE BLOCK_BLANK

## Sheet POWER-BUDGET.SchDoc
size A4; SheetNumber: 7; SheetTotal: 7
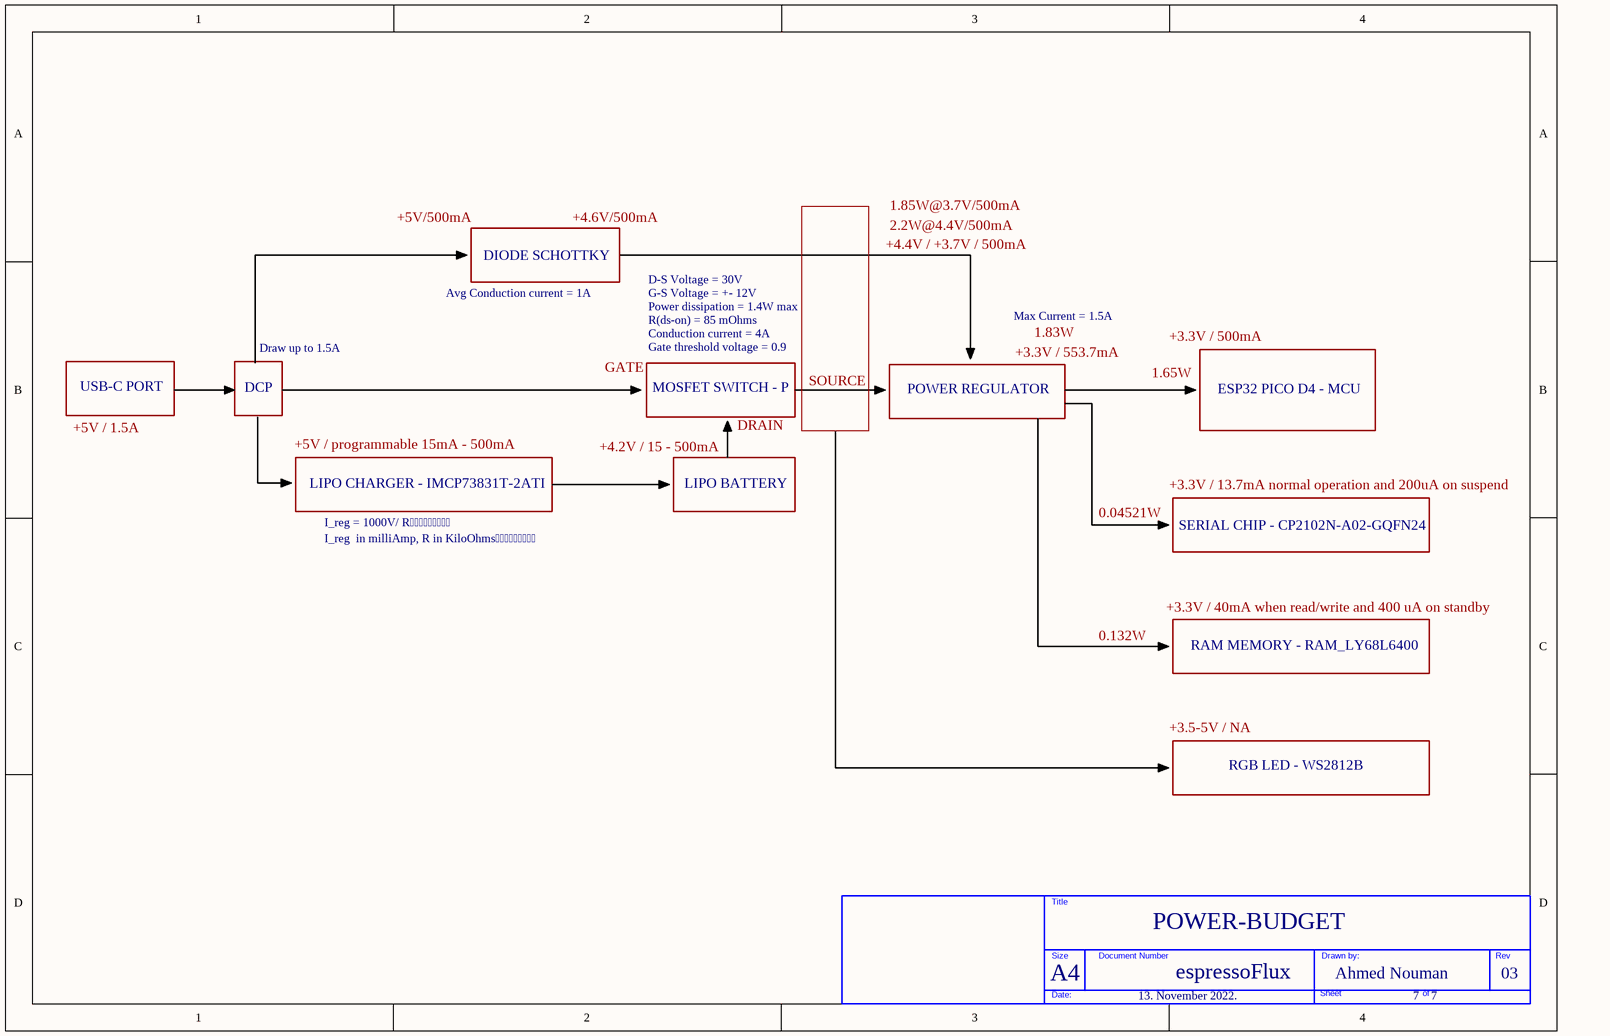
[diagram p6: POWER-BUDGET.SchDoc]

### Parts
(Parts that share a designator on the sheet are numbered #1, #2 ... from top to bottom, then left to right.)
?#7  (no value)  (graphical)

### Notes on the sheet
- +5V/500mA
- +4.6V/500mA
- +4.4V / +3.7V / 500mA
- 2.2W@4.4V/500mA
- 1.85W@3.7V/500mA
- Avg Conduction current = 1A
- DIODE SCHOTTKY
- Power dissipation = 1.4W max
- G-S Voltage = +- 12V
- D-S Voltage = 30V
- Draw up to 1.5A
- GATE
- Gate threshold voltage = 0.9
- Conduction current = 4A
- R(ds-on) = 85 mOhms
- SOURCE
- Max Current = 1.5A
- +3.3V / 553.7mA
- 1.83W
- 1.65W
- +3.3V / 500mA
- +5V / 1.5A
- USB-C PORT
- DCP
- +5V / programmable 15mA - 500mA
- +4.2V / 15 - 500mA
- MOSFET SWITCH - P
- DRAIN
- POWER REGULATOR
- ESP32 PICO D4 - MCU
- LIPO CHARGER - IMCP73831T-2ATI
- LIPO BATTERY
- 0.04521W
- +3.3V / 13.7mA normal operation and 200uA on suspend
- I_reg = 1000V/ R
- I_reg  in milliAmp, R in KiloOhms
- SERIAL CHIP - CP2102N-A02-GQFN24
- 0.132W
- +3.3V / 40mA when read/write and 400 uA on standby
- RAM MEMORY - RAM_LY68L6400
- +3.5-5V / NA
- RGB LED - WS2812B
- A4
- POWER-BUDGET
- espressoFlux
- Ahmed Nouman
- 03
- 13. November 2022.
- 7    7
- Title
- Size
- Document Number
- Drawn by:
- Rev
- Date:
- Sheet
- of

### Library data of the parts
?#7 = TITLE BLOCK_BLANK

## Nets that join several sheets
+3V3: ESP32-PICO-D4-MCU (22 pins), POWER-BATTERY (C26.2 L2.2), RESET-SWITCHES (8 pins), SERIAL-CHIP (8 pins)
GND: ESP32-PICO-D4-MCU (19 pins), POWER-BATTERY (16 pins), RESET-SWITCHES (23 pins), SERIAL-CHIP (22 pins)
VIN: POWER-BATTERY (5 pins), RESET-SWITCHES (C2.2 C28.2 LED1.1 R27.2)
BT1: ESP32-PICO-D4-MCU (U4.16), RESET-SWITCHES (C29.2 R6.1 S3.1 S3.2)
BT2: ESP32-PICO-D4-MCU (U4.24), RESET-SWITCHES (C31.2 R9.1 S6.1 S6.2)
BT3: ESP32-PICO-D4-MCU (U4.25), RESET-SWITCHES (C34.2 R11.1 S8.1 S8.2)
BT4: ESP32-PICO-D4-MCU (U4.11), RESET-SWITCHES (C35.2 R10.1 S7.1 S7.2)
BT5: ESP32-PICO-D4-MCU (U4.14), RESET-SWITCHES (C32.2 R8.1 S5.1 S5.2)
BT6: ESP32-PICO-D4-MCU (U4.13), RESET-SWITCHES (C30.2 R7.1 S4.1 S4.2)
D_LED: ESP32-PICO-D4-MCU (U4.38), RESET-SWITCHES (Q1.2)
GPIO0: ESP32-PICO-D4-MCU (U4.23), SERIAL-CHIP (J5.2 Q4.2)
LEVEL_BAT: ESP32-PICO-D4-MCU (U4.5), POWER-BATTERY (C15.2 R20.1 R21.2)
RESET: ESP32-PICO-D4-MCU (C6.2 R24.1 U4.9), RESET-SWITCHES (C33.2 R1.2 S1.1), SERIAL-CHIP (J5.1 Q2.3)
RXD: ESP32-PICO-D4-MCU (U4.40), SERIAL-CHIP (J3.1 U2.21)
TXD: ESP32-PICO-D4-MCU (R23.2), SERIAL-CHIP (J3.2 U2.20)
VBUS: POWER-BATTERY (7 pins), SERIAL-CHIP (7 pins)